# EasyEDA Pro project hera2.eprj

# Schematic hera-0-gate-nor-2
Board Name: hera-0-gate-nor-2; Create Date: 2025-05-25; Page Name: P1; Project Name: hera-0-gate-nor-2; Schematic Name: hera-0-gate-nor-2; Update Date: 2025-05-25; Company: EasyEDA.com; Page Size: A4; Version: V1.0
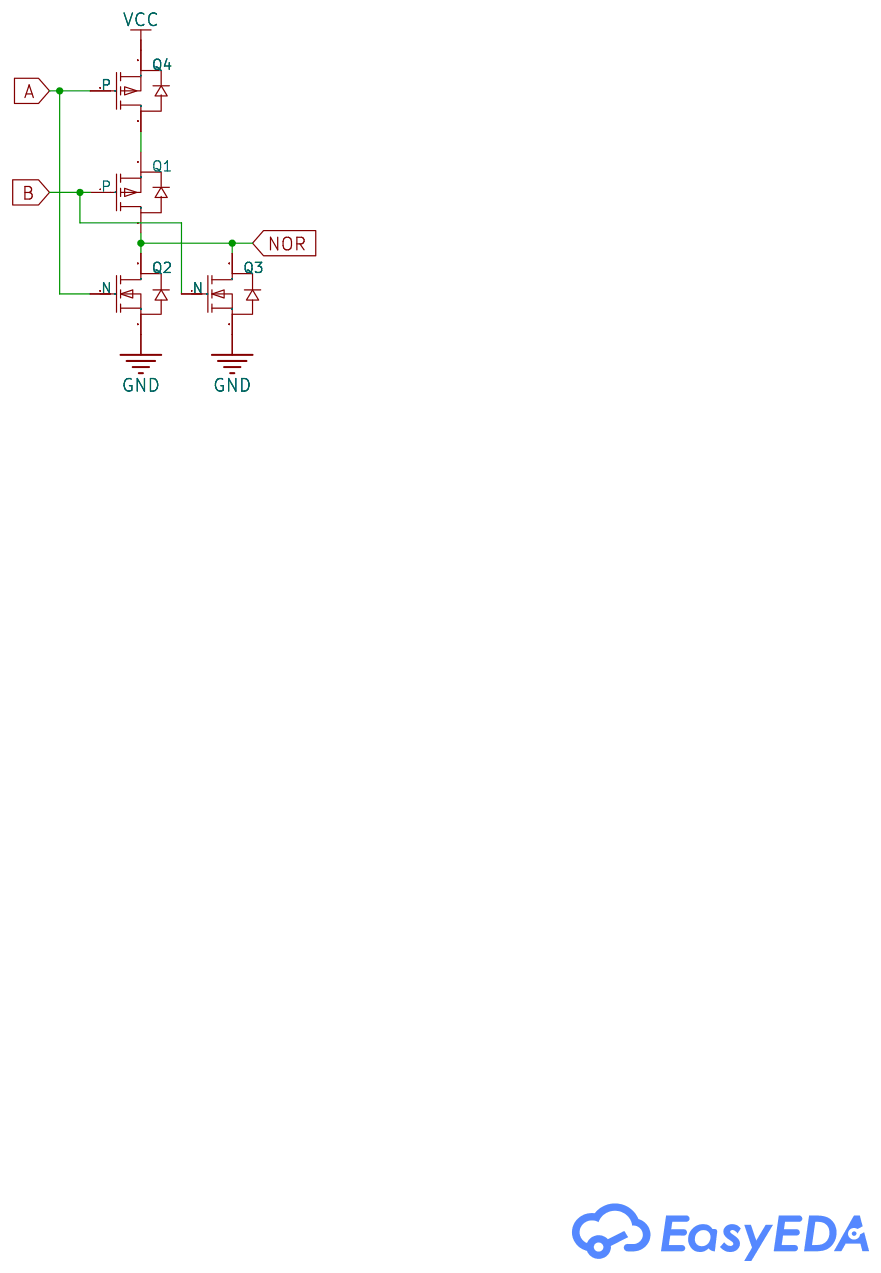
[diagram p0: schematic sheet]

## Parts
Q1  P  [SOT-23-3_L2.9-W1.3-P1.90-LS2.4-BR]
Q2  N  [SOT-23-3_L2.9-W1.3-P1.90-LS2.4-BR]
Q3  N  [SOT-23-3_L2.9-W1.3-P1.90-LS2.4-BR]
Q4  P  [SOT-23-3_L2.9-W1.3-P1.90-LS2.4-BR]

## Library data of the parts
Q1 Q4 = SI2301_C2891731: Type:1 piece P-channel Drain to Source Voltage:20V Current - Continuous Drain(Id): RDS(on):120mΩ@4.5V,1.5A Pd - Power Dissipation:700mW Gate Threshold Voltage (Vgs(th)@Id):- Gate Charge(Qg):- Input Capacitance(Ciss@Vds):200pF@10V Reverse Transfer Capacita; LCSC Part Name: P沟道,电流:2.2A,耐压:20V; Supplier Part: C2891731; Manufacturer: YONGYUTAI(永裕泰); Manufacturer Part: SI2301; Supplier Footprint: SOT-23; JLCPCB Part Class: Extended Part; Datasheet: https://atta.szlcsc.com/upload/public/pdf/source/20210901/BD7F488CADB80954861F21BEE026F08A.pdf; Supplier: LCSC; Type: 1 piece P-channel; Drain to Source Voltage: 20V; RDS(on): 120mΩ@4.5V,1.5A; Pd - Power Dissipation: 700mW; Input Capacitance(Ciss@Vds): 200pF@10V; Operating Temperature: -55℃~+150℃
Q2 Q3 = SI2302_C2891732: Type:1 N-channel Drain to Source Voltage:20V Current - Continuous Drain(Id):3A RDS(on):0.05Ω@4.5V,3A Pd - Power Dissipation: Gate Threshold Voltage (Vgs(th)@Id):1V Gate Charge(Qg):- Input Capacitance(Ciss@Vds):300pF@10V Reverse Transfer Capacitance (Crss@; LCSC Part Name: N沟道,电流:3A,耐压:20V; Supplier Part: C2891732; Manufacturer: YONGYUTAI(永裕泰); Manufacturer Part: SI2302; Supplier Footprint: SOT-23; JLCPCB Part Class: Extended Part; Datasheet: https://atta.szlcsc.com/upload/public/pdf/source/20210901/467BBA277A18343FF82D7D641AA41F7C.pdf; Supplier: LCSC; Type: 1 N-channel; Drain to Source Voltage: 20V; Current - Continuous Drain(Id): 3A; RDS(on): 0.05Ω@4.5V,3A; Gate Threshold Voltage (Vgs(th)@Id): 1V; Input Capacitance(Ciss@Vds): 300pF@10V; Reverse Transfer Capacitance (Crss@Vds): 80pF@10V; Operating Temperature: -55℃~+150℃

## Nets
GND: Q2.2(S) Q3.2(S)
VCC: Q4.2(S)
A: Q2.1(G) Q4.1(G)
B: Q1.1(G) Q3.1(G)
NOR: Q1.3(D) Q2.3(D) Q3.3(D)
$1N233: Q1.2(S) Q4.3(D)

# Board PCB2
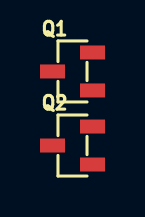
[diagram p1: board, top side]
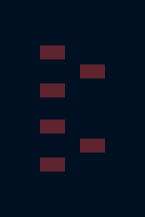
[diagram p2: board, bottom side, seen from below]

No outline. copper layers: Top Layer, Bottom Layer. Coordinates in mm from the lowest, leftmost part position.
Stack: Top Layer 0.035mm / Dielectric1 1.51mm FR4 er 4.5 / Bottom Layer 0.035mm

## Design rules (mm)
template: JLCPCB Capability(Two Layers Board)
spacing copperThickness1oz (default): track to track 0.102, other pairs 0.152 to 0.3
spacing copperThickness2oz: track to track 0.203, other pairs 0.152 to 0.3
track width copperThickness1oz (default): min 0.127, default 0.254, max 2.54
track width copperThickness2oz: min 0.203, default 0.254, max 2.54
differential pair differentialPair (default): width min 0.127, default 0.254, max 2.54; gap min 0.152, default 0.152
via viaSize (default): diameter min 0.5, default 0.61, max 10; hole min 0.3, default 0.305, max 6.3

## Placement (name value [footprint] x y rotation side)
Q1  SI2301  [SOT-23-3_L2.9-W1.3-P1.90-LS2.4-BR]  0 3.7 0 top
Q2  SI2302  [SOT-23-3_L2.9-W1.3-P1.90-LS2.4-BR]  0 0 0 top

## Footprints (pads in the part's own frame, mm; a bottom-side part is the same pattern mirrored in y, then rotated)
SOT-23-3_L2.9-W1.3-P1.90-LS2.4-BR
  rect 1.25x0.7 smd: 1(1,-0.95) 2(1,0.95) 3(-1,0)

## Nets

Pads without a net: Q1 1 2 3; Q2 1 2 3

# Board hera-0-gate-nor-2
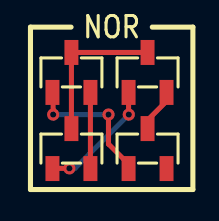
[diagram p3: board, top side]
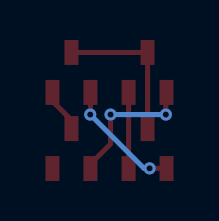
[diagram p4: board, bottom side, seen from below]

No outline. copper layers: Top Layer, Bottom Layer. Coordinates in mm from the lowest, leftmost part position.
Stack: Top Layer 0.035mm / Dielectric1 1.51mm FR4 er 4.5 / Bottom Layer 0.035mm

## Design rules (mm)
template: JLCPCB Capability(Two Layers Board)
spacing copperThickness1oz (default): track to track 0.102, other pairs 0.152 to 0.3
spacing copperThickness2oz: track to track 0.203, other pairs 0.152 to 0.3
track width copperThickness1oz (default): min 0.127, default 0.254, max 2.54
track width copperThickness2oz: min 0.203, default 0.254, max 2.54
differential pair differentialPair (default): width min 0.127, default 0.254, max 2.54; gap min 0.152, default 0.152
via viaSize (default): diameter min 0.5, default 0.61, max 10; hole min 0.3, default 0.305, max 6.3

## Placement (name value [footprint] x y rotation side)
Q1  P  [SOT-23-3_L2.9-W1.3-P1.90-LS2.4-BR]  3.81 3.81 270 top
Q2  N  [SOT-23-3_L2.9-W1.3-P1.90-LS2.4-BR]  0 3.81 270 top
Q3  N  [SOT-23-3_L2.9-W1.3-P1.90-LS2.4-BR]  0 0 270 top
Q4  P  [SOT-23-3_L2.9-W1.3-P1.90-LS2.4-BR]  3.81 0 270 top

## Footprints (pads in the part's own frame, mm; a bottom-side part is the same pattern mirrored in y, then rotated)
SOT-23-3_L2.9-W1.3-P1.90-LS2.4-BR
  rect 1.25x0.7 smd: 1(1,-0.95) 2(1,0.95) 3(-1,0)

## Nets
As in the schematic.

## Via types
v1: diameter 0.61, hole 0.305, Top Layer to Bottom Layer, 4 vias

## Routing (per net, layer and track width the routed paths; a pad name or vN(x,y) marks a point on that pad's centre or on a via; arc(x,y) is an arc through that point)
GND: length 3.8
  Top Layer w0.254: Q3.2 Q2.2
A: length 7
  Top Layer w0.254: Q2.1 -0.91,2.77 v1(-0.91,1.7) ; v1(1.85,1.7) 1.85,0.23 2.86,-0.78 Q4.1
  Bottom Layer w0.254: v1(1.85,1.7) v1(-0.91,1.7)
B: length 6.1
  Top Layer w0.254: v1(2.87,1.7) 2.86,1.71 Q1.1 ; v1(-0.1,-0.99) -0.94,-0.99 Q3.1
  Bottom Layer w0.254: v1(-0.1,-0.99) 0.18,-0.99 v1(2.87,1.7)
NOR: length 7.6
  Top Layer w0.254: Q3.3 Q2.3 Q1.3
$1N233: length 2.2
  Top Layer w0.254: Q1.2 4.76,2.37 3.81,1.42 Q4.3

## Text on the board
Top Silkscreen Layer: NOR
